# EAGLE design servoyolu_5servo (EAGLE 9.6.2)
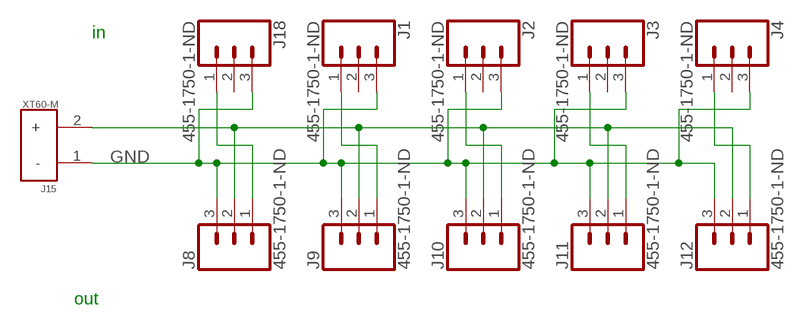
[diagram p0: schematic, sheet 1]

## Parts
J1  455-1750-1-ND  CONN_03  [1X03]
J2  455-1750-1-ND  CONN_03  [1X03]
J3  455-1750-1-ND  CONN_03  [1X03]
J4  455-1750-1-ND  CONN_03  [1X03]
J8  455-1750-1-ND  CONN_03  [1X03]
J9  455-1750-1-ND  CONN_03  [1X03]
J10  455-1750-1-ND  CONN_03  [1X03]
J11  455-1750-1-ND  CONN_03  [1X03]
J12  455-1750-1-ND  CONN_03  [1X03]
J15  XT60-M  [AMASS_XT60-M]
J18  455-1750-1-ND  CONN_03  [1X03]

## Nets
GND: J1.3 J2.3 J3.3 J4.3 J8.3 J9.3 J10.3 J11.3 J12.3 J15.1(-) J18.3
N$1: J8.1 J18.1
N$2: J1.1 J9.1
N$3: J2.1 J10.1
N$4: J3.1 J11.1
N$5: J4.1 J12.1
N$9: J8.2 J9.2 J10.2 J11.2 J12.2 J15.2(+)
Unconnected: J1.2 J2.2 J3.2 J4.2 J18.2

## Notes on the sheet
- in
- out

## Library data of the parts
J1-J4 J8-J12 J18 = SparkFun-Connectors:CONN_03: Multi connection point. Often used as Generic Header-pin footprint for 0.1 inch spaced/style header connections On any of the 0.1 inch spaced packages, you can populate with these: Break Away Headers - Straight <https://www.sparkfun.com/products/116> (PRT-00116) Break Away Male Headers - Right Angle <https://www.sparkfun.com/products/553> (PRT-00553) Female Headers <https://www.sparkfun.com/products/115> (PRT-00115) Break Away Headers - Machine Pin <https://www.sparkfun.com/products/117> (PRT-00117) Break Away Female Headers - Swiss Machine Pin <https://www.sparkfun.com/products/743> (PRT-00743) Stackable Header - 3 Pin (Female, 0.1") <https://www.sparkfun.com/products/13875> (PRT-13875) For SCREWTERMINALS and SPRING TERMINALS visit here: Screw Terimnals on SparkFun.com <https://www.sparkfun.com/search/results?term=Screw+Terminals> (5mm/3.5mm/2.54mm spacing) This device is also useful as a general connection point to wire up your design to another part of your project. Our various solder wires solder well into these plated through hole pads. Hook-Up Wire - Assortment (Stranded, 22 AWG) <https://www.sparkfun.com/products/11375> (PRT-11375) Hook-Up Wire - Assortment (Solid Core, 22 AWG) <https://www.sparkfun.com/products/11367> (PRT-11367) View the entire wire category on our website here <https://www.sparkfun.com/categories/141> Special notes: Molex polarized connector foot print use with SKU : PRT-08232 with associated crimp pins and housings.; PROD_ID: XXX-00000
J15 = XT60-M:XT60-M: DC supply; XT60; male; PIN:2; for cable; soldered; 60A; 500V; AVAILABILITY: Unavailable; DESCRIPTION: Plug; DC supply; XT60; male; PIN: 2; for cable; soldered; 30A; 500V; MF: AMASS; MP: XT60-M; PACKAGE: Package; PRICE: None

## Board
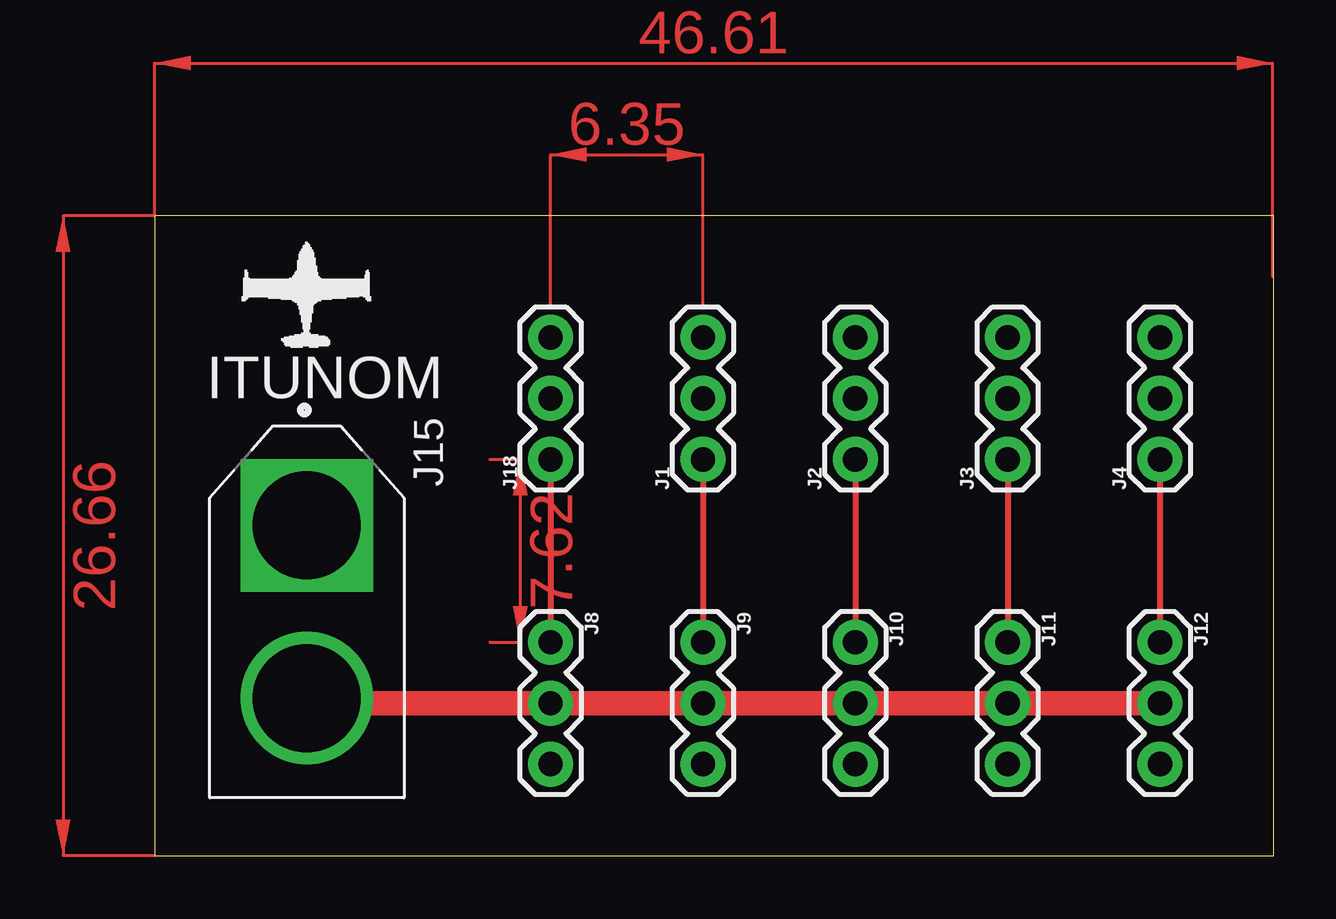
[diagram p1: board, top side]
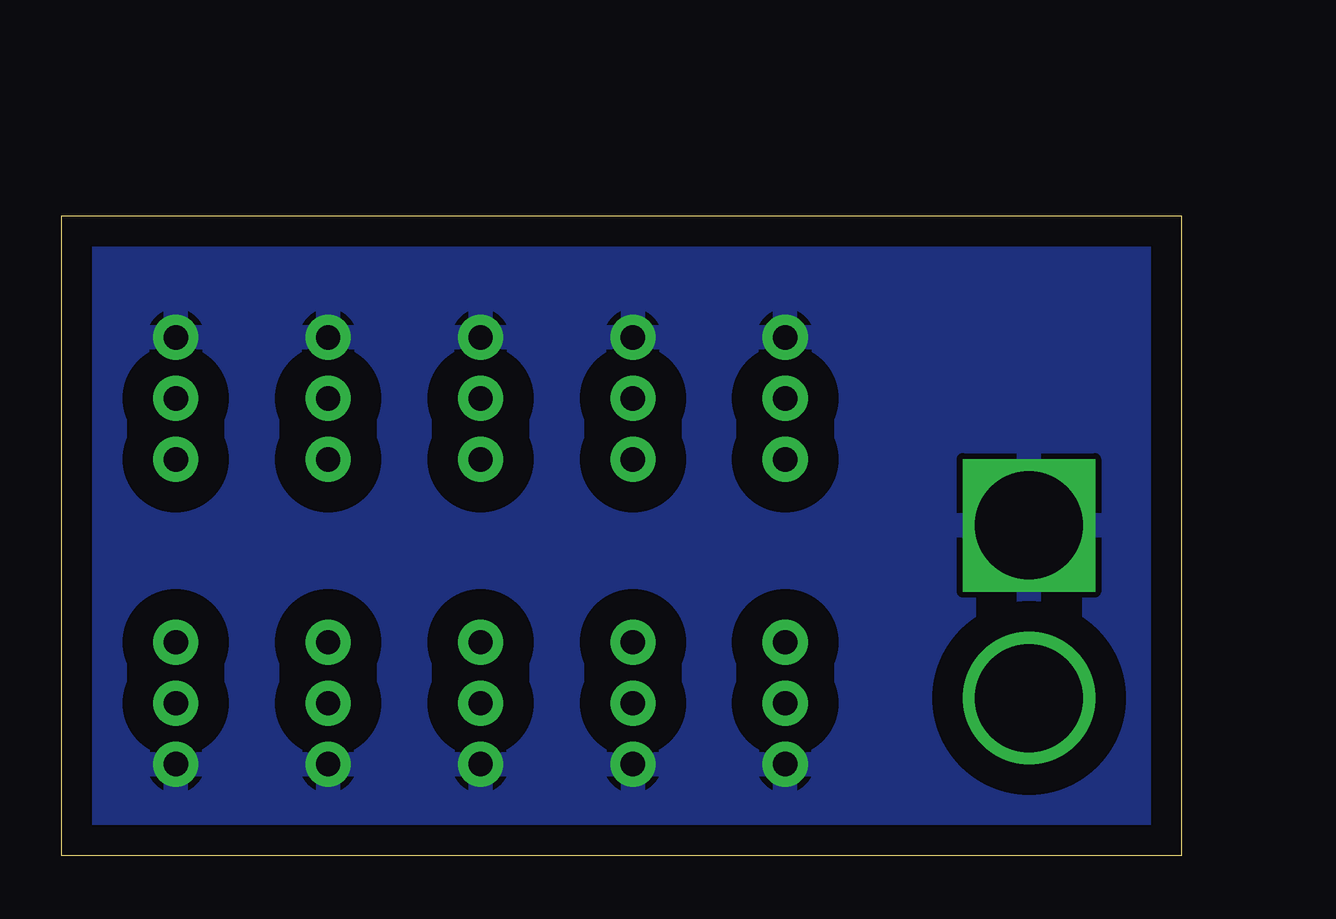
[diagram p2: board, bottom side, seen from below]

Size 46.66 x 26.66 mm. Coordinates in mm from the lower left corner, seen from the top.
Outline: 0,0 46.66,0 46.66,26.66 0,26.66 0,0
Copper layers (1*16): Top 0.035mm / dielectric 1.5mm / Bottom 0.035mm
Design rules "default": minimum track width 6mil, minimum drill 0.35mm, track to track 6mil, track to pad 6mil, pad to pad 6mil, via to via 6mil, smd to smd 6mil, copper to edge 40mil, drill to drill 6mil, minimum pad ring 10mil, minimum via ring 8mil, stop-mask expansion 4mil, vias tented up to drill 0mil, thermal gap 10mil

### Footprints (pad centres in the part's own frame; a part is rotated, then mirrored left to right if it is on the bottom)
1X03 = drill 1.016 pad 1.88: 1 0,0; 2 2.54,0; 3 5.08,0
AMASS_XT60-M = drill 4.5 square: 1 -3.6,0 | drill 4.5: 2 3.6,0

### Placement (x,y rotation side)
J1  22.86,16.51 90 top
J2  29.21,16.51 90 top
J3  35.56,16.51 90 top
J4  41.91,16.51 90 top
J8  16.51,8.89 270 top
J9  22.86,8.89 270 top
J10  29.21,8.89 270 top
J11  35.56,8.89 270 top
J12  41.91,8.89 270 top
J15  6.35,10.16 270 top
J18  16.51,16.51 90 top

### Tracks (layer width: path | path; a pad name or v marks a point on that pad's centre or on a via)
GND
  pour Bottom (isolate 1.27): 0,26.67 46.99,26.67 46.99,0 0,0
N$1
  Top 0.254: J18.1 J8.1
N$2
  Top 0.254: J1.1 J9.1
N$3
  Top 0.254: J2.1 J10.1
N$4
  Top 0.254: J3.1 J11.1
N$5
  Top 0.254: J4.1 J12.1
N$9
  Top 1.016: J15.2 6.56,6.35 J8.2 J9.2 J10.2 J11.2 J12.2
(copper drawn outside any net)
  shapes: Top area x4

### Text on the board
tNames: ITUNOM